# Altium schematic sheet Master_flying_pcb_v1.SchDoc
size A3
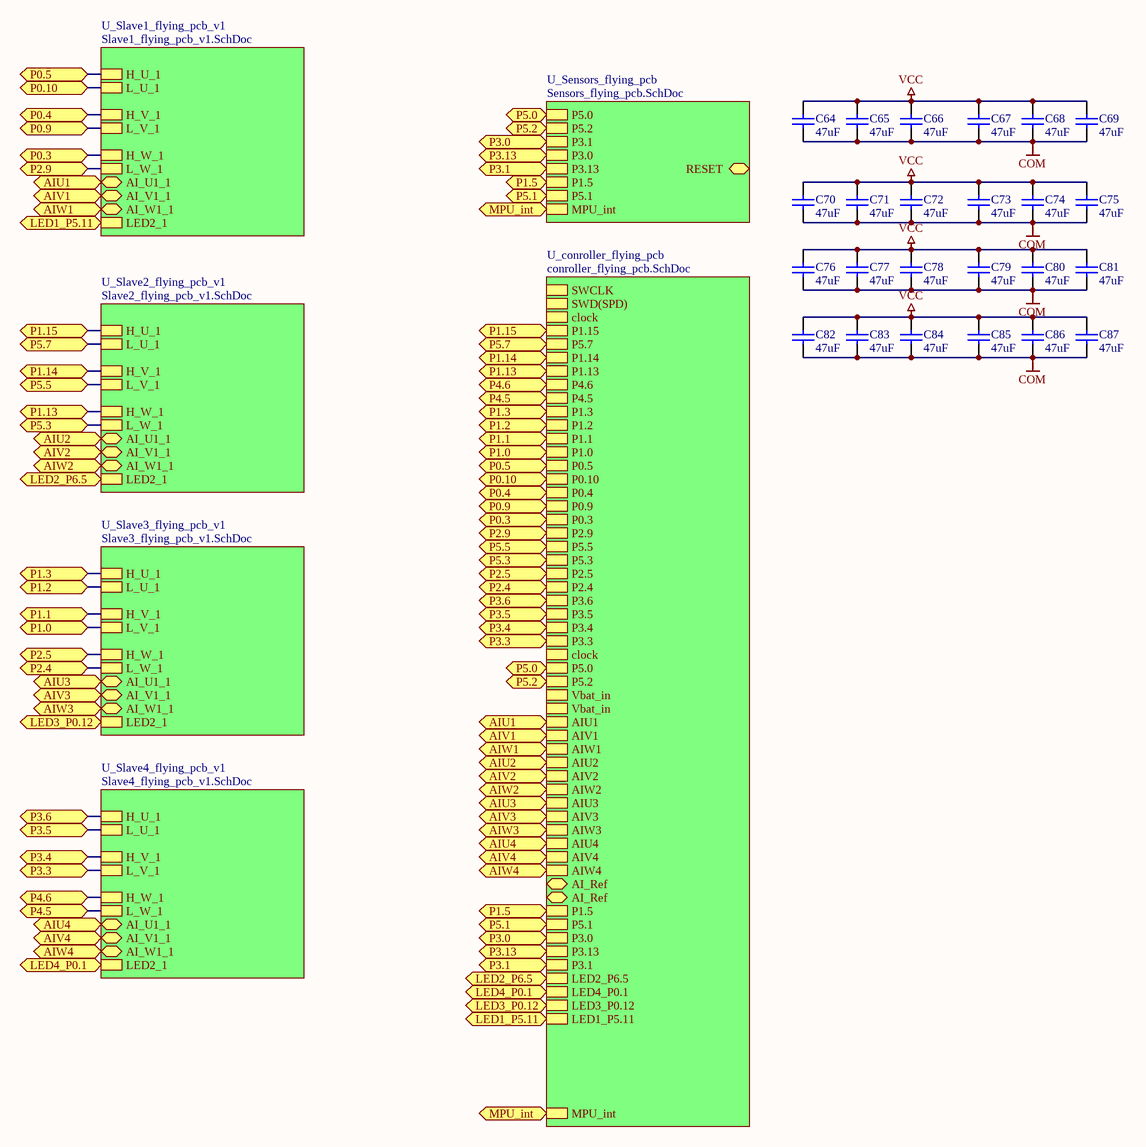
[diagram p0: Master_flying_pcb_v1.SchDoc]

## Parts
C64  47uF  [_0805]
C65  47uF  [_0805]
C66  47uF  [_0805]
C67  47uF  [_0805]
C68  47uF  [_0805]
C69  47uF  [_0805]
C70  47uF  [_0805]
C71  47uF  [_0805]
C72  47uF  [_0805]
C73  47uF  [_0805]
C74  47uF  [_0805]
C75  47uF  [_0805]
C76  47uF  [_0805]
C77  47uF  [_0805]
C78  47uF  [_0805]
C79  47uF  [_0805]
C80  47uF  [_0805]
C81  47uF  [_0805]
C82  47uF  [_0805]
C83  47uF  [_0805]
C84  47uF  [_0805]
C85  47uF  [_0805]
C86  47uF  [_0805]
C87  47uF  [_0805]

## Sub-sheets
U_conroller_flying_pcb = conroller_flying_pcb.SchDoc: SWCLK, SWD(SPD), clock, P1.15, P5.7, P1.14, P1.13, P4.6, P4.5, P1.3, P1.2, P1.1, P1.0, P0.5, P0.10, P0.4, P0.9, P0.3, P2.9, P5.5, P5.3, P2.5, P2.4, P3.6, P3.5, P3.4, P3.3, clock, P5.0, P5.2, Vbat_in, Vbat_in, AIU1, AIV1, AIW1, AIU2, AIV2, AIW2, AIU3, AIV3, AIW3, AIU4, AIV4, AIW4, AI_Ref (bidir), AI_Ref (bidir), P1.5, P5.1, P3.0, P3.13, P3.1, LED2_P6.5, LED4_P0.1, LED3_P0.12, LED1_P5.11, MPU_int
U_Sensors_flying_pcb = Sensors_flying_pcb.SchDoc: P5.0, P5.2, P3.1, P3.0, P3.13, P1.5, P5.1, MPU_int, RESET
U_Slave1_flying_pcb_v1 = Slave1_flying_pcb_v1.SchDoc: H_U_1, L_U_1, H_V_1, L_V_1, H_W_1, L_W_1, AI_U1_1 (bidir), AI_V1_1 (bidir), AI_W1_1 (bidir), LED2_1
U_Slave2_flying_pcb_v1 = Slave2_flying_pcb_v1.SchDoc: H_U_1, L_U_1, H_V_1, L_V_1, H_W_1, L_W_1, AI_U1_1 (bidir), AI_V1_1 (bidir), AI_W1_1 (bidir), LED2_1
U_Slave3_flying_pcb_v1 = Slave3_flying_pcb_v1.SchDoc: H_U_1, L_U_1, H_V_1, L_V_1, H_W_1, L_W_1, AI_U1_1 (bidir), AI_V1_1 (bidir), AI_W1_1 (bidir), LED2_1
U_Slave4_flying_pcb_v1 = Slave4_flying_pcb_v1.SchDoc: H_U_1, L_U_1, H_V_1, L_V_1, H_W_1, L_W_1, AI_U1_1 (bidir), AI_V1_1 (bidir), AI_W1_1 (bidir), LED2_1

## Ports
AIU1, AIU2, AIU3, AIU4, AIV1, AIV2, AIV3, AIV4, AIW1, AIW2, AIW3, AIW4, LED1_P5.11, LED2_P6.5, LED3_P0.12, LED4_P0.1, MPU_int, P0.3, P0.4, P0.5, P0.9, P0.10, P1.0, P1.1, P1.2, P1.3, P1.5, P1.13, P1.14, P1.15, P2.4, P2.5, P2.9, P3.0, P3.1, P3.3, P3.4, P3.5, P3.6, P3.13, P4.5, P4.6, P5.0, P5.1, P5.2, P5.3, P5.5, P5.7

## Nets
COM: C64.1 C65.1 C66.1 C67.1 C68.1 C69.1 C70.1 C71.1 C72.1 C73.1 C74.1 C75.1 C76.1 C77.1 C78.1 C79.1 C80.1 C81.1 C82.1 C83.1 C84.1 C85.1 C86.1 C87.1
VCC: C64.2 C65.2 C66.2 C67.2 C68.2 C69.2 C70.2 C71.2 C72.2 C73.2 C74.2 C75.2 C76.2 C77.2 C78.2 C79.2 C80.2 C81.2 C82.2 C83.2 C84.2 C85.2 C86.2 C87.2
AIU1: port AIU1, sheet U_Slave1_flying_pcb_v1/AI_U1_1, sheet U_conroller_flying_pcb/AIU1
AIU2: port AIU2, sheet U_Slave2_flying_pcb_v1/AI_U1_1, sheet U_conroller_flying_pcb/AIU2
AIU3: port AIU3, sheet U_Slave3_flying_pcb_v1/AI_U1_1, sheet U_conroller_flying_pcb/AIU3
AIU4: port AIU4, sheet U_Slave4_flying_pcb_v1/AI_U1_1, sheet U_conroller_flying_pcb/AIU4
AIV1: port AIV1, sheet U_Slave1_flying_pcb_v1/AI_V1_1, sheet U_conroller_flying_pcb/AIV1
AIV2: port AIV2, sheet U_Slave2_flying_pcb_v1/AI_V1_1, sheet U_conroller_flying_pcb/AIV2
AIV3: port AIV3, sheet U_Slave3_flying_pcb_v1/AI_V1_1, sheet U_conroller_flying_pcb/AIV3
AIV4: port AIV4, sheet U_Slave4_flying_pcb_v1/AI_V1_1, sheet U_conroller_flying_pcb/AIV4
AIW1: port AIW1, sheet U_Slave1_flying_pcb_v1/AI_W1_1, sheet U_conroller_flying_pcb/AIW1
AIW2: port AIW2, sheet U_Slave2_flying_pcb_v1/AI_W1_1, sheet U_conroller_flying_pcb/AIW2
AIW3: port AIW3, sheet U_Slave3_flying_pcb_v1/AI_W1_1, sheet U_conroller_flying_pcb/AIW3
AIW4: port AIW4, sheet U_Slave4_flying_pcb_v1/AI_W1_1, sheet U_conroller_flying_pcb/AIW4
LED1_P5.11: port LED1_P5.11, sheet U_Slave1_flying_pcb_v1/LED2_1, sheet U_conroller_flying_pcb/LED1_P5.11
LED2_P6.5: port LED2_P6.5, sheet U_Slave2_flying_pcb_v1/LED2_1, sheet U_conroller_flying_pcb/LED2_P6.5
LED3_P0.12: port LED3_P0.12, sheet U_Slave3_flying_pcb_v1/LED2_1, sheet U_conroller_flying_pcb/LED3_P0.12
LED4_P0.1: port LED4_P0.1, sheet U_Slave4_flying_pcb_v1/LED2_1, sheet U_conroller_flying_pcb/LED4_P0.1
MPU_int: port MPU_int, sheet U_Sensors_flying_pcb/MPU_int, sheet U_conroller_flying_pcb/MPU_int
P0.3: port P0.3, sheet U_Slave1_flying_pcb_v1/H_W_1, sheet U_conroller_flying_pcb/P0.3
P0.4: port P0.4, sheet U_Slave1_flying_pcb_v1/H_V_1, sheet U_conroller_flying_pcb/P0.4
P0.5: port P0.5, sheet U_Slave1_flying_pcb_v1/H_U_1, sheet U_conroller_flying_pcb/P0.5
P0.9: port P0.9, sheet U_Slave1_flying_pcb_v1/L_V_1, sheet U_conroller_flying_pcb/P0.9
P0.10: port P0.10, sheet U_Slave1_flying_pcb_v1/L_U_1, sheet U_conroller_flying_pcb/P0.10
P1.0: port P1.0, sheet U_Slave3_flying_pcb_v1/L_V_1, sheet U_conroller_flying_pcb/P1.0
P1.1: port P1.1, sheet U_Slave3_flying_pcb_v1/H_V_1, sheet U_conroller_flying_pcb/P1.1
P1.2: port P1.2, sheet U_Slave3_flying_pcb_v1/L_U_1, sheet U_conroller_flying_pcb/P1.2
P1.3: port P1.3, sheet U_Slave3_flying_pcb_v1/H_U_1, sheet U_conroller_flying_pcb/P1.3
P1.5: port P1.5, sheet U_Sensors_flying_pcb/P1.5, sheet U_conroller_flying_pcb/P1.5
P1.13: port P1.13, sheet U_Slave2_flying_pcb_v1/H_W_1, sheet U_conroller_flying_pcb/P1.13
P1.14: port P1.14, sheet U_Slave2_flying_pcb_v1/H_V_1, sheet U_conroller_flying_pcb/P1.14
P1.15: port P1.15, sheet U_Slave2_flying_pcb_v1/H_U_1, sheet U_conroller_flying_pcb/P1.15
P2.4: port P2.4, sheet U_Slave3_flying_pcb_v1/L_W_1, sheet U_conroller_flying_pcb/P2.4
P2.5: port P2.5, sheet U_Slave3_flying_pcb_v1/H_W_1, sheet U_conroller_flying_pcb/P2.5
P2.9: port P2.9, sheet U_Slave1_flying_pcb_v1/L_W_1, sheet U_conroller_flying_pcb/P2.9
P3.0: port P3.0, sheet U_Sensors_flying_pcb/P3.1, sheet U_conroller_flying_pcb/P3.0
P3.1: port P3.1, sheet U_Sensors_flying_pcb/P3.13, sheet U_conroller_flying_pcb/P3.1
P3.3: port P3.3, sheet U_Slave4_flying_pcb_v1/L_V_1, sheet U_conroller_flying_pcb/P3.3
P3.4: port P3.4, sheet U_Slave4_flying_pcb_v1/H_V_1, sheet U_conroller_flying_pcb/P3.4
P3.5: port P3.5, sheet U_Slave4_flying_pcb_v1/L_U_1, sheet U_conroller_flying_pcb/P3.5
P3.6: port P3.6, sheet U_Slave4_flying_pcb_v1/H_U_1, sheet U_conroller_flying_pcb/P3.6
P3.13: port P3.13, sheet U_Sensors_flying_pcb/P3.0, sheet U_conroller_flying_pcb/P3.13
P4.5: port P4.5, sheet U_Slave4_flying_pcb_v1/L_W_1, sheet U_conroller_flying_pcb/P4.5
P4.6: port P4.6, sheet U_Slave4_flying_pcb_v1/H_W_1, sheet U_conroller_flying_pcb/P4.6
P5.0: port P5.0, sheet U_Sensors_flying_pcb/P5.0, sheet U_conroller_flying_pcb/P5.0
P5.1: port P5.1, sheet U_Sensors_flying_pcb/P5.1, sheet U_conroller_flying_pcb/P5.1
P5.2: port P5.2, sheet U_Sensors_flying_pcb/P5.2, sheet U_conroller_flying_pcb/P5.2
P5.3: port P5.3, sheet U_Slave2_flying_pcb_v1/L_W_1, sheet U_conroller_flying_pcb/P5.3
P5.5: port P5.5, sheet U_Slave2_flying_pcb_v1/L_V_1, sheet U_conroller_flying_pcb/P5.5
P5.7: port P5.7, sheet U_Slave2_flying_pcb_v1/L_U_1, sheet U_conroller_flying_pcb/P5.7

## Library data of the parts
C64-C87 = Cap_128: Name: Cap_0805; QR: 0; UID: Cap_128; ComponentLink1URL: #NAME?; mounting: SMD